# Altium schematic sheet LED.SchDoc
size A4; SheetNumber: 1
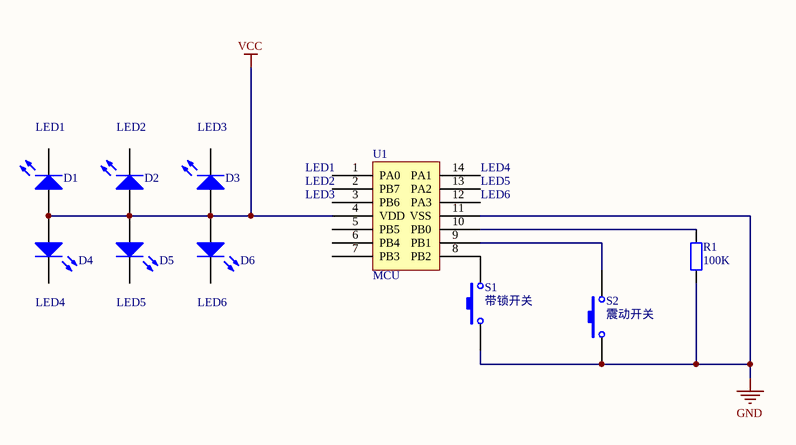
[diagram p0: LED.SchDoc]

## Parts
D1  LED  [LED_A1]  (value not drawn)
D2  LED  [LED_A1]  (value not drawn)
D3  LED  [LED_A1]  (value not drawn)
D4  LED  [LED_A1]  (value not drawn)
D5  LED  [LED_A1]  (value not drawn)
D6  LED  [LED_A1]  (value not drawn)
R1  100K  [R 0805_L]
S1  带锁开关  [SW_PB2_A1]
S2  震动开关  [SW_PB2_A1]
U1  MCU

## Nets
GND: R1.2 S1.1 S2.1 U1.11(VSS)
VCC: D1.1(A) D2.1(A) D3.1(A) D4.1(A) D5.1(A) D6.1(A) U1.4(VDD)
NetR1_1: R1.1 U1.10(PB0)
NetS1_2: S1.2 U1.8(PB2)
NetS2_2: S2.2 U1.9(PB1)

Not connected (* = marked no-connect by the designer): D1 2(K); D2 2(K); D3 2(K); D4 2(K); D5 2(K); D6 2(K); U1 1(PA0) 2(PB7) 3(PB6) 5(PB5) 6(PB4) 7(PB3) 12(PA3) 13(PA2) 14(PA1)

## Notes on the sheet
- (near D1) LED1
- (near D2) LED2
- (near D3) LED3
- (near U1) LED1
- (near U1) LED2
- (near U1) LED3
- (near U1) LED4
- (near U1) LED5
- (near U1) LED6
- (near D4) LED4
- (near D5) LED5
- (near D6) LED6

## Library data of the parts
D1-D6 = LED: 发光二极管; 技术支持，联系售后: https://shop463601444.taobao.com
R1 = R: 下拉电阻; BOM名称: 贴片电阻; 版权归属: 来自淘宝 ID：黄晶宝石; 封装库来自淘宝卖家 ID：黄晶宝石: 其他店铺购入均为盗版，不享受售后技术支持服务，请立即申请退款; 联系售后: https://shop463601444.taobao.com
S1 S2 = SW-PB: 微动开关; Published: 24-Mar-1999; LatestRevisionDate: 17-Jul-2002; LatestRevisionNote: Re-released for DXP Platform.; PackageReference: SPST-2; Publisher: Altium Limited
U1 = NY8A053D_SOP14: 53D_sop14